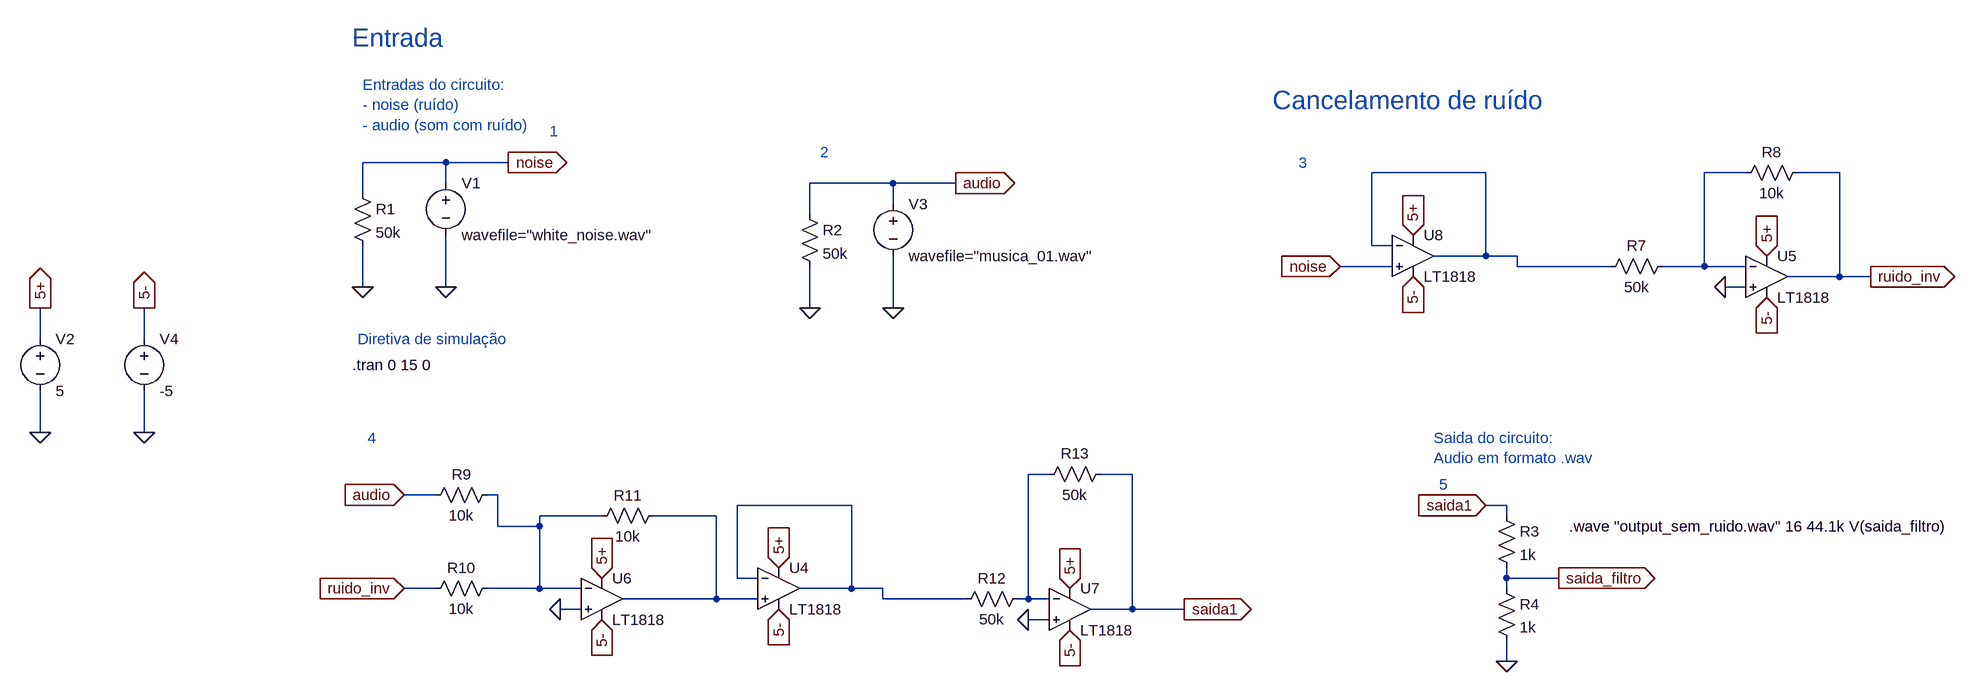
[diagram p0: schematic circuito_cancela.asc]
circuito_cancela.asc, the LTspice schematic file:
Version 4
SHEET 1 3960 3408
WIRE -672 -96 -800 -96
WIRE -576 -96 -672 -96
WIRE 928 -80 752 -80
WIRE 1328 -80 1264 -80
WIRE 1472 -80 1408 -80
WIRE -672 -64 -672 -96
WIRE 16 -64 -112 -64
WIRE 112 -64 16 -64
WIRE -800 -48 -800 -96
WIRE 16 -32 16 -64
WIRE -112 -16 -112 -64
WIRE 752 32 752 -80
WIRE 784 32 752 32
WIRE 928 48 928 -80
WIRE 928 48 848 48
WIRE 976 48 928 48
WIRE 784 64 704 64
WIRE 976 64 976 48
WIRE 1120 64 976 64
WIRE 1264 64 1264 -80
WIRE 1264 64 1200 64
WIRE 1328 64 1264 64
WIRE 1472 80 1472 -80
WIRE 1472 80 1392 80
WIRE 1520 80 1472 80
WIRE -800 96 -800 32
WIRE -672 96 -672 16
WIRE 1328 96 1296 96
WIRE -112 128 -112 64
WIRE 16 128 16 48
WIRE -1296 176 -1296 128
WIRE -1136 176 -1136 128
WIRE -1296 320 -1296 256
WIRE -1136 320 -1136 256
WIRE 256 384 224 384
WIRE 384 384 336 384
WIRE -688 416 -736 416
WIRE -592 416 -608 416
WIRE -48 432 -224 432
WIRE 960 432 928 432
WIRE -432 448 -528 448
WIRE -256 448 -352 448
WIRE 960 448 960 432
WIRE -592 464 -592 416
WIRE -528 464 -528 448
WIRE -528 464 -592 464
WIRE -224 544 -224 432
WIRE -192 544 -224 544
WIRE 960 544 960 528
WIRE 1040 544 960 544
WIRE -688 560 -736 560
WIRE -528 560 -528 464
WIRE -528 560 -608 560
WIRE -464 560 -528 560
WIRE -48 560 -48 432
WIRE -48 560 -128 560
WIRE 0 560 -48 560
WIRE 960 560 960 544
WIRE -256 576 -256 448
WIRE -256 576 -400 576
WIRE -192 576 -256 576
WIRE 0 576 0 560
WIRE 128 576 0 576
WIRE 224 576 224 384
WIRE 224 576 208 576
WIRE 256 576 224 576
WIRE -464 592 -496 592
WIRE 384 592 384 384
WIRE 384 592 320 592
WIRE 464 592 384 592
WIRE 256 608 224 608
WIRE 960 672 960 640
FLAG -672 96 0
FLAG -800 96 0
FLAG 16 128 0
FLAG -112 128 0
FLAG -576 -96 noise
IOPIN -576 -96 Out
FLAG 112 -64 audio
IOPIN 112 -64 Out
FLAG 960 672 0
FLAG 928 432 saida1
IOPIN 928 432 In
FLAG 1040 544 saida_filtro
IOPIN 1040 544 Out
FLAG -1296 320 0
FLAG -1296 128 5+
IOPIN -1296 128 Out
FLAG -1136 320 0
FLAG -1136 128 5-
IOPIN -1136 128 Out
FLAG 1360 48 5+
IOPIN 1360 48 In
FLAG 1360 112 5-
IOPIN 1360 112 In
FLAG 1520 80 ruido_inv
IOPIN 1520 80 Out
FLAG -736 416 audio
IOPIN -736 416 In
FLAG -736 560 ruido_inv
IOPIN -736 560 In
FLAG -432 544 5+
IOPIN -432 544 In
FLAG -432 608 5-
IOPIN -432 608 In
FLAG 288 560 5+
IOPIN 288 560 In
FLAG 288 624 5-
IOPIN 288 624 In
FLAG 464 592 saida1
IOPIN 464 592 Out
FLAG 1296 96 0
FLAG 224 608 0
FLAG -496 592 0
FLAG 704 64 noise
IOPIN 704 64 In
FLAG -160 528 5+
IOPIN -160 528 In
FLAG -160 592 5-
IOPIN -160 592 In
FLAG 816 16 5+
IOPIN 816 16 In
FLAG 816 80 5-
IOPIN 816 80 In
SYMBOL voltage -672 -80 R0
SYMATTR InstName V1
SYMATTR Value wavefile="white_noise.wav"
SYMBOL res -816 -64 R0
SYMATTR InstName R1
SYMATTR Value 50k
SYMBOL voltage 16 -48 R0
SYMATTR InstName V3
SYMATTR Value wavefile="musica_01.wav"
SYMBOL res -128 -32 R0
SYMATTR InstName R2
SYMATTR Value 50k
SYMBOL res 944 432 R0
SYMATTR InstName R3
SYMATTR Value 1k
SYMBOL res 944 544 R0
SYMATTR InstName R4
SYMATTR Value 1k
SYMBOL voltage -1296 160 R0
SYMATTR InstName V2
SYMATTR Value 5
SYMBOL voltage -1136 160 R0
WINDOW 123 0 0 Left 0
WINDOW 39 0 0 Left 0
SYMATTR InstName V4
SYMATTR Value -5
SYMBOL res 1216 48 R90
WINDOW 0 0 56 VBottom 2
WINDOW 3 32 56 VTop 2
SYMATTR InstName R7
SYMATTR Value 50k
SYMBOL OpAmps\\LT1818 1360 80 R0
SYMATTR InstName U5
SYMBOL res 1424 -96 R90
WINDOW 0 0 56 VBottom 2
WINDOW 3 32 56 VTop 2
SYMATTR InstName R8
SYMATTR Value 10k
SYMBOL res -592 400 R90
WINDOW 0 0 56 VBottom 2
WINDOW 3 32 56 VTop 2
SYMATTR InstName R9
SYMATTR Value 10k
SYMBOL res -592 544 R90
WINDOW 0 0 56 VBottom 2
WINDOW 3 32 56 VTop 2
SYMATTR InstName R10
SYMATTR Value 10k
SYMBOL OpAmps\\LT1818 -432 576 R0
SYMATTR InstName U6
SYMBOL res -336 432 R90
WINDOW 0 0 56 VBottom 2
WINDOW 3 32 56 VTop 2
SYMATTR InstName R11
SYMATTR Value 10k
SYMBOL res 224 560 R90
WINDOW 0 0 56 VBottom 2
WINDOW 3 32 56 VTop 2
SYMATTR InstName R12
SYMATTR Value 50k
SYMBOL OpAmps\\LT1818 288 592 R0
SYMATTR InstName U7
SYMBOL res 352 368 R90
WINDOW 0 0 56 VBottom 2
WINDOW 3 32 56 VTop 2
SYMATTR InstName R13
SYMATTR Value 50k
SYMBOL OpAmps\\LT1818 -160 560 R0
SYMATTR InstName U4
SYMBOL OpAmps\\LT1818 816 48 R0
SYMATTR InstName U8
TEXT -816 216 Left 2 !.tran 0 15 0
TEXT 1056 464 Left 2 !.wave "output_sem_ruido.wav" 16 44.1k V(saida_filtro)
TEXT -800 -216 Left 2 ;Entradas do circuito:\n- noise (ruído)\n- audio (som com ruído)
TEXT -808 176 Left 2 ;Diretiva de simulação
TEXT 848 328 Left 2 ;Saida do circuito:\nAudio em formato .wav
TEXT -512 -144 Left 2 ;1
TEXT -96 -112 Left 2 ;2
TEXT 640 -96 Left 2 ;3
TEXT -792 328 Left 2 ;4
TEXT 856 400 Left 2 ;5
TEXT 600 -192 Left 4 ;Cancelamento de ruído
TEXT -816 -288 Left 4 ;Entrada

The netlist it stands for:
* circuito_cancela.asc
V1 noise 0 wavefile="white_noise.wav"
R1 noise 0 50k
V3 audio 0 wavefile="musica_01.wav"
R2 audio 0 50k
R3 saida1 saida_filtro 1k
R4 saida_filtro 0 1k
V2 5+ 0 5
V4 5- 0 -5
R7 N002 N001 50k
XU5 0 N002 ruido_inv 5+ 5- LT1818  ; pins In+ In- OUT V+ V-
R8 ruido_inv N002 10k
R9 N004 audio 10k
R10 N004 ruido_inv 10k
XU6 0 N004 N006 5+ 5- LT1818  ; pins In+ In- OUT V+ V-
R11 N006 N004 10k
R12 N003 N005 50k
XU7 0 N003 saida1 5+ 5- LT1818  ; pins In+ In- OUT V+ V-
R13 saida1 N003 50k
XU4 N006 N005 N005 5+ 5- LT1818  ; pins In+ In- OUT V+ V-
XU8 noise N001 N001 5+ 5- LT1818  ; pins In+ In- OUT V+ V-
.tran 0 15 0
.wave "output_sem_ruido.wav" 16 44.1k V(saida_filtro)
* Entradas do circuito:
* - noise (ruído)
* - audio (som com ruído)
* Diretiva de simulação
* Saida do circuito:
* Audio em formato .wav
* 1
* 2
* 3
* 4
* 5
* Cancelamento de ruído
* Entrada
.lib LTC2.lib
.backanno
.end